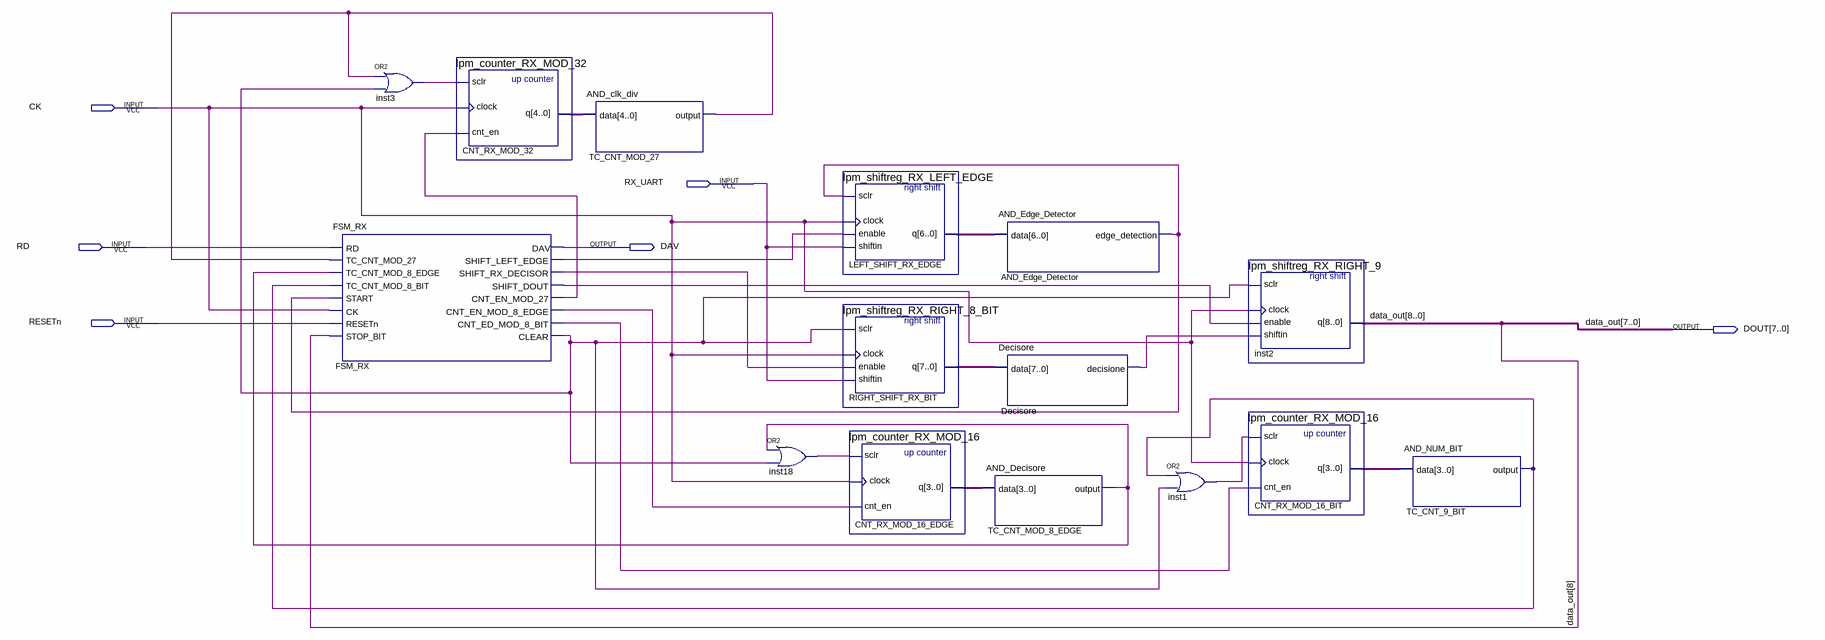
[diagram p0: schematic sheet]
// Quartus schematic RX.bdf as structural Verilog: 15 symbols, 6 pins
module RX (
  input  CK,
  input  RX_UART,
  input  RD,
  input  RESETn,
  output DAV,
  output [7:0] DOUT
);

  wire AND_Edge_Detector_edge_detection, Decisore_decisione, FSM_RX_clear, FSM_RX_cnt_ed_mod_8_bit,
       FSM_RX_cnt_en_mod_8_edge, FSM_RX_cnt_en_mod_27, FSM_RX_shift_dout, FSM_RX_shift_left_edge,
       FSM_RX_shift_rx_decisor, inst1_out, inst3_out, inst18_out, TC_CNT_9_BIT_output,
       TC_CNT_MOD_8_EDGE_output, TC_CNT_MOD_27_output;
  wire [3:0] CNT_RX_MOD_16_BIT_q, CNT_RX_MOD_16_EDGE_q;
  wire [4:0] CNT_RX_MOD_32_q;
  wire [6:0] LEFT_SHIFT_RX_EDGE_q;
  wire [7:0] RIGHT_SHIFT_RX_BIT_q;
  wire [8:8] data_out;

  FSM_RX FSM_RX (
    .RD(RD), .TC_CNT_MOD_27(TC_CNT_MOD_27_output), .TC_CNT_MOD_8_EDGE(TC_CNT_MOD_8_EDGE_output),
    .TC_CNT_MOD_8_BIT(TC_CNT_9_BIT_output), .START(AND_Edge_Detector_edge_detection), .CK(CK),
    .RESETn(RESETn), .STOP_BIT(data_out[8]), .DAV(DAV), .SHIFT_LEFT_EDGE(FSM_RX_shift_left_edge),
    .SHIFT_RX_DECISOR(FSM_RX_shift_rx_decisor), .SHIFT_DOUT(FSM_RX_shift_dout),
    .CNT_EN_MOD_27(FSM_RX_cnt_en_mod_27), .CNT_EN_MOD_8_EDGE(FSM_RX_cnt_en_mod_8_edge),
    .CNT_ED_MOD_8_BIT(FSM_RX_cnt_ed_mod_8_bit), .CLEAR(FSM_RX_clear));
  or inst3 (inst3_out, TC_CNT_MOD_27_output, FSM_RX_clear);
  lpm_counter_RX_MOD_32 CNT_RX_MOD_32 (
    .sclr(inst3_out), .clock(CK), .cnt_en(FSM_RX_cnt_en_mod_27), .q(CNT_RX_MOD_32_q));
  AND_clk_div TC_CNT_MOD_27 (.data(CNT_RX_MOD_32_q), .\output (TC_CNT_MOD_27_output));
  or inst18 (inst18_out, TC_CNT_MOD_8_EDGE_output, FSM_RX_clear);
  lpm_shiftreg_RX_LEFT_EDGE LEFT_SHIFT_RX_EDGE (
    .sclr(AND_Edge_Detector_edge_detection), .clock(CK), .enable(FSM_RX_shift_left_edge), .shiftin(RX_UART),
    .q(LEFT_SHIFT_RX_EDGE_q));
  lpm_shiftreg_RX_RIGHT_8_BIT RIGHT_SHIFT_RX_BIT (
    .sclr(FSM_RX_clear), .clock(CK), .enable(FSM_RX_shift_rx_decisor), .shiftin(RX_UART),
    .q(RIGHT_SHIFT_RX_BIT_q));
  lpm_counter_RX_MOD_16 CNT_RX_MOD_16_EDGE (
    .sclr(inst18_out), .clock(CK), .cnt_en(FSM_RX_cnt_en_mod_8_edge), .q(CNT_RX_MOD_16_EDGE_q));
  AND_Edge_Detector AND_Edge_Detector (.data(LEFT_SHIFT_RX_EDGE_q), .edge_detection(AND_Edge_Detector_edge_detection));
  Decisore Decisore (.data(RIGHT_SHIFT_RX_BIT_q), .decisione(Decisore_decisione));
  AND_Decisore TC_CNT_MOD_8_EDGE (.data(CNT_RX_MOD_16_EDGE_q), .\output (TC_CNT_MOD_8_EDGE_output));
  or inst1 (inst1_out, TC_CNT_9_BIT_output, FSM_RX_clear);
  lpm_shiftreg_RX_RIGHT_9 inst2 (
    .sclr(FSM_RX_clear), .clock(CK), .enable(FSM_RX_shift_dout), .shiftin(Decisore_decisione),
    .q({data_out[8], DOUT}));
  lpm_counter_RX_MOD_16 CNT_RX_MOD_16_BIT (
    .sclr(inst1_out), .clock(CK), .cnt_en(FSM_RX_cnt_ed_mod_8_bit), .q(CNT_RX_MOD_16_BIT_q));
  AND_NUM_BIT TC_CNT_9_BIT (.data(CNT_RX_MOD_16_BIT_q), .\output (TC_CNT_9_BIT_output));

  // Other names for the same wires on the sheet: data_out[7:0] = DOUT
endmodule
